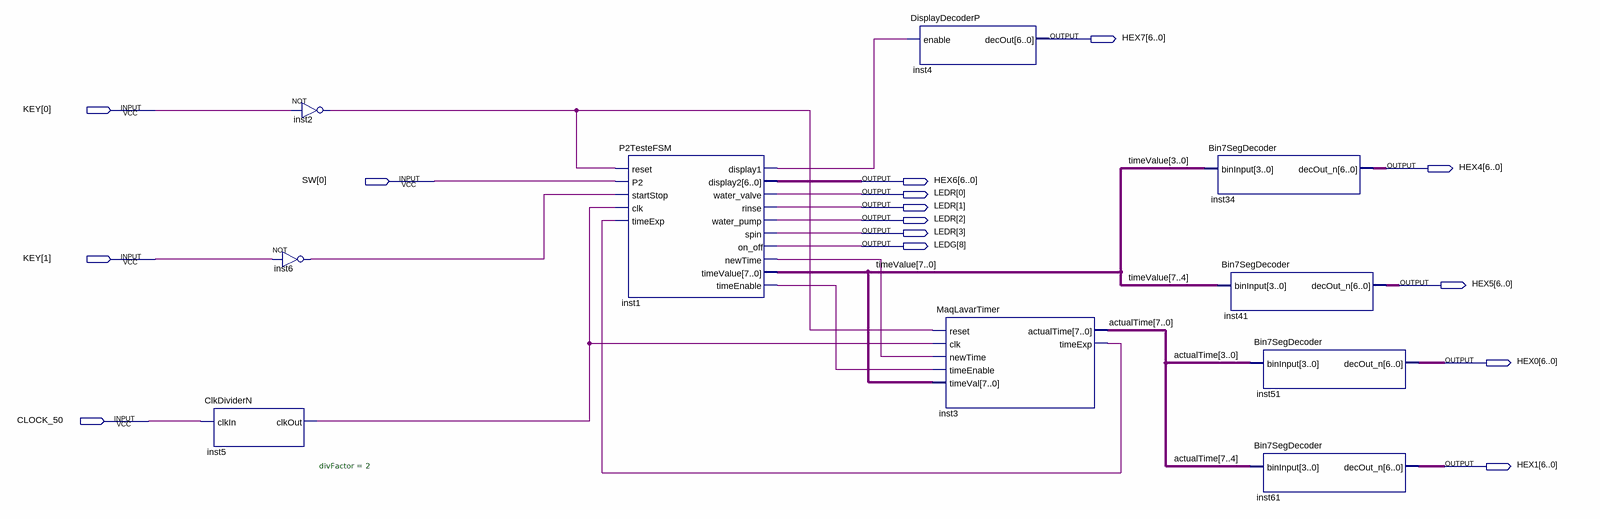
[diagram p0: schematic sheet]
// Quartus schematic P2Teste.bdf as structural Verilog: 10 symbols, 15 pins
module P2Teste (
  input  [1:0] KEY,
  input  [0:0] SW,
  input  CLOCK_50,
  output [6:0] HEX7,
  output [6:0] HEX4,
  output [6:0] HEX6,
  output [3:0] LEDR,
  output [8:8] LEDG,
  output [6:0] HEX5,
  output [6:0] HEX0,
  output [6:0] HEX1
);

  wire inst1_display1, inst1_newtime, inst1_timeenable, inst2_out, inst3_timeexp, inst5_clkout, inst6_out;
  wire [7:0] actualTime, timeValue;

  ClkDividerN #(.divFactor(2)) inst5 (.clkIn(CLOCK_50), .clkOut(inst5_clkout));
  not inst2 (inst2_out, KEY[0]);
  not inst6 (inst6_out, KEY[1]);
  P2TesteFSM inst1 (
    .reset(inst2_out), .P2(SW[0]), .startStop(inst6_out), .clk(inst5_clkout), .timeExp(inst3_timeexp),
    .display1(inst1_display1), .display2(HEX6), .water_valve(LEDR[0]), .rinse(LEDR[1]), .water_pump(LEDR[2]),
    .spin(LEDR[3]), .on_off(LEDG[8]), .newTime(inst1_newtime), .timeValue(timeValue),
    .timeEnable(inst1_timeenable));
  DisplayDecoderP inst4 (.enable(inst1_display1), .decOut(HEX7));
  MaqLavarTimer inst3 (
    .reset(inst2_out), .clk(inst5_clkout), .newTime(inst1_newtime), .timeEnable(inst1_timeenable),
    .timeVal(timeValue), .actualTime(actualTime), .timeExp(inst3_timeexp));
  Bin7SegDecoder inst34 (.binInput(timeValue[3:0]), .decOut_n(HEX4));
  Bin7SegDecoder inst41 (.binInput(timeValue[7:4]), .decOut_n(HEX5));
  Bin7SegDecoder inst51 (.binInput(actualTime[3:0]), .decOut_n(HEX0));
  Bin7SegDecoder inst61 (.binInput(actualTime[7:4]), .decOut_n(HEX1));
endmodule
